# Altium project GPStracker.PrjPcb
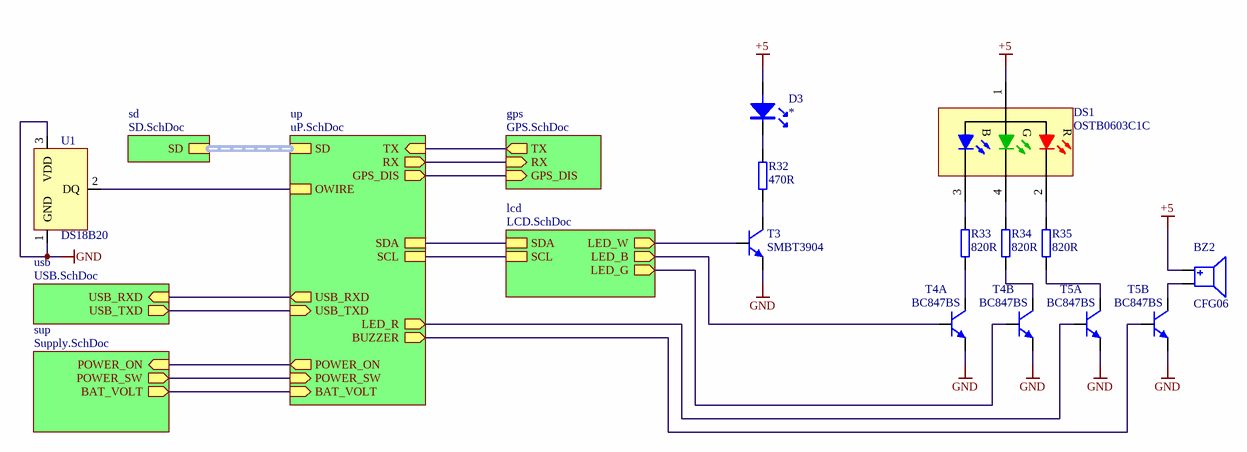
[diagram p0: MAIN.SchDoc]
PCBName: 01; PCBVersion: 2206; PRJName: GPST
7 sheets, 151 parts. Net scope: hierarchical (ports join the sheet entries above them; power ports are global).
Board file: GPST.PcbDoc
Sheets:
  MAIN.SchDoc
    sd = SD.SchDoc
    gps = GPS.SchDoc
    up = uP.SchDoc
    lcd = LCD.SchDoc
    usb = USB.SchDoc
    sup = Supply.SchDoc

## Sheet MAIN.SchDoc: =VariantName
size 274 x 177 mm; Revision: 2206; SheetNumber: 1; SheetTotal: 7; BoardName: GPST-01; ProjectName: GPStracker.PrjPcb

### Parts
BZ2  CFG06  [CFG-06]
D3  *  [LED_0805]
DS1  OSTB0603C1C  [LED0603_4]
R32  470R  [R0805]
R33  820R  [R0805]
R34  820R  [R0805]
R35  820R  [R0805]
T3  SMBT3904  [SOT23J]
T4  BC847BS  [SOT363]  (parts A,B of 2)
T5  BC847BS  [SOT363]  (parts A,B of 2)
U1  DS18B20  [TO-92]

### Sub-sheets
gps = GPS.SchDoc: TX (out), RX (in), GPS_DIS (in)
lcd = LCD.SchDoc: SDA, SCL, LED_G (out), LED_B (out), LED_W (out)
sd = SD.SchDoc: SD
sup = Supply.SchDoc: POWER_ON (in), POWER_SW (out), BAT_VOLT (out)
up = uP.SchDoc: TX (in), RX (out), SDA, OWIRE, SCL, USB_TXD (in), USB_RXD (out), SD (harness SD), GPS_DIS (out), BUZZER (out), LED_R (out), POWER_ON (out), POWER_SW (in), BAT_VOLT (in)
usb = USB.SchDoc: USB_TXD (out), USB_RXD (in)

### Nets
+5: BZ2.+ D3.A DS1.1(A2)
GND: T3.1(E) T4.1(E1) T4.4(E2) T5.1(E1) T5.4(E2) U1.1(GND) U1.3(VDD)
BAT_VOLT: sheet up/BAT_VOLT, sheet sup/BAT_VOLT
BUZZER: T5.5(B2) ; sheet up/BUZZER
GPS_DIS: sheet gps/GPS_DIS, sheet up/GPS_DIS
LED_B: T4.2(B1) ; sheet lcd/LED_B
LED_G: T4.5(B2) ; sheet lcd/LED_G
LED_R: T5.2(B1) ; sheet up/LED_R
LED_W: T3.2(B) ; sheet lcd/LED_W
OWIRE: U1.2(DQ) ; sheet up/OWIRE
POWER_ON: sheet up/POWER_ON, sheet sup/POWER_ON
POWER_SW: sheet up/POWER_SW, sheet sup/POWER_SW
SCL: sheet up/SCL, sheet lcd/SCL
SDA: sheet up/SDA, sheet lcd/SDA
USB_RXD: sheet up/USB_RXD, sheet usb/USB_RXD
USB_TXD: sheet up/USB_TXD, sheet usb/USB_TXD
NetBZ2_-: BZ2.- T5.6(C2)
NetD3_K: D3.K R32.2
NetDS1_2: DS1.2(R) R35.1
NetDS1_3: DS1.3(B) R33.1
NetDS1_4: DS1.4(G) R34.1
NetR10_2: sheet gps/TX, sheet up/TX
NetR11_2: sheet gps/RX, sheet up/RX
NetR32_1: R32.1 T3.3(C)
NetR33_2: R33.2 T4.3(C1)
NetR34_2: R34.2 T4.6(C2)
NetR35_2: R35.2 T5.3(C1)

### Buses and harness runs
harness sheet sd/SD = sheet up/SD

### Notes on the sheet
- Name:
- Device:
- File:

### Library data of the parts
BZ2 = CFG06: BUZZER;; Indeks: MAKB002; P&P: 0; Value: CFG06
D3 = LED: LED;; Indeks: *; Value: *; P&P: *
DS1 = OPTOSUPPLY OSTB0603C1C: LED, RGB, SMD; Indeks: MOPSL068; Obudowa: LED0603; P&P: 1; Value: OSTB0603C1C
R32-R35 = R: R; resistor; Indeks: *; P&P: *
  R32: Value: 470R
  R33-R35: Value: 820R
T3 = SMBT3904: T_NPN; Bipolar Transistor; Indeks: MTRSB002; P&P: 1; Value: SMBT3904
T4 T5 = BC847BS: T_NPN; Bipolar Transistor; pin to pad: 3>6 6>3; Indeks: MTRSB057; P&P: 1; Value: BC847BS
U1 = DS18B20: temperature sensor; Indeks: MUKTC049; P&P: 0; Value: DS18B20

## Sheet SD.SchDoc: =VariantName
size 274 x 177 mm; Revision: 2206; SheetNumber: 2; SheetTotal: 7; BoardName: GPST-01; ProjectName: GPStracker.PrjPcb
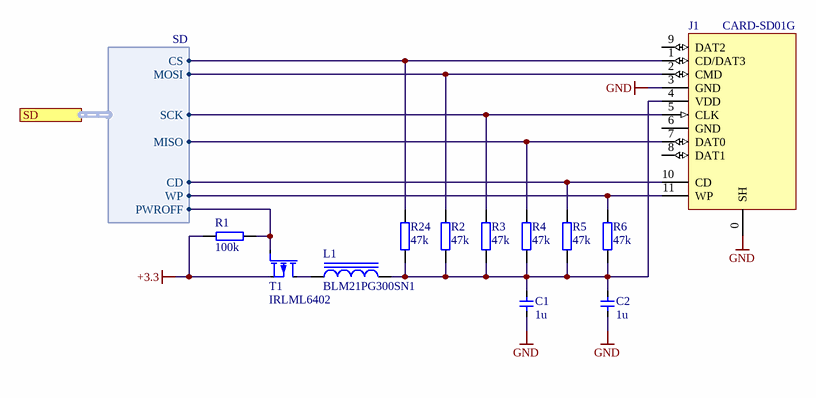
[diagram p1: SD.SchDoc]

### Parts
C1  1u  [C0805]
C2  1u  [C0805]
J1  CARD-SD01G  [CARD-SD01G]
L1  BLM21PG300SN1  [L0805]
R1  100k  [R0805]
R2  47k  [R0805]
R3  47k  [R0805]
R4  47k  [R0805]
R5  47k  [R0805]
R6  47k  [R0805]
R24  47k  [R0805]
T1  IRLML6402  [MICRO3]

### Ports
SD (harness SD)

### Harnesses
SD: PWROFF, CD, WP, CS, MOSI, MISO, SCK

### Nets
+3.3: R1.2 T1.S
GND: C1.1 C2.1 J1.0(SH) J1.3(GND)
SD.CD: J1.10(CD) R5.2 ; port SD.CD
SD.CS: J1.1(CD/DAT3) R24.2 ; port SD.CS
SD.MISO: J1.7(DAT0) R4.2 ; port SD.MISO
SD.MOSI: J1.2(CMD) R2.2 ; port SD.MOSI
SD.PWROFF: R1.1 T1.G ; port SD.PWROFF
SD.SCK: J1.5(CLK) R3.2 ; port SD.SCK
SD.WP: J1.11(WP) R6.2 ; port SD.WP
NetC1_2: C1.2 C2.2 J1.4(VDD) L1.2 R2.1 R3.1 R4.1 R5.1 R6.1 R24.1
NetL1_1: L1.1 T1.D

Not connected (* = marked no-connect by the designer): J1 6(GND) 8(DAT1) 9(DAT2)

### Notes on the sheet
- Name:
- Device:
- File:

### Library data of the parts
C1 C2 = C: C; capacitor; Value: 1u; P&P: *
J1 = SD: SD Card Socket, push-pull; ID: 631; Order Code: CARD-SD01G-LF; Part No: CARD-SD01G; Supplier: Maritex
L1 = BLM21PG300SN1: L;; Indeks: MIDSD062; P&P: 1; Value: BLM21PG300SN1
R1-R6 R24 = R: R; resistor; Indeks: *; P&P: *
  R1: Value: 100k
  R2-R6 R24: Value: 47k
T1 = IRLML6402: T_M_P; P-Channel MOSFET; Indeks: MTRSP030; P&P: 1; Value: IRLML6402

## Sheet GPS.SchDoc: =VariantName
size 274 x 177 mm; Revision: 2206; SheetNumber: 3; SheetTotal: 7; BoardName: GPST-01; ProjectName: GPStracker.PrjPcb
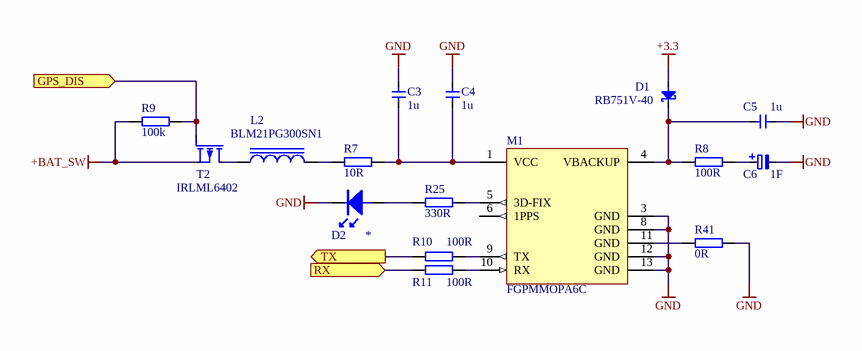
[diagram p2: GPS.SchDoc]

### Parts
C3  1u  [C0805]
C4  1u  [C0805]
C5  1u  [C0805]
C6  1F  [EECRG0V105H]
D1  RB751V-40  [SOD323]
D2  *  [LED_0805]
L2  BLM21PG300SN1  [L0805]
M1  FGPMMOPA6C  [FGPMMOPA6C]
R7  10R  [R0805]
R8  100R  [R0805]
R9  100k  [R0805]
R10  100R  [R0805]
R11  100R  [R0805]
R25  330R  [R0805]
R41  0R  [R0805]
T2  IRLML6402  [MICRO3]

### Ports
GPS_DIS (in), RX (in), TX (out)

### Nets
+3.3: D1.A
+BAT_SW: R9.2 T2.S
GND: C3.1 C4.1 C5.1 C6.- D2.K M1.3(GND) M1.8(GND) M1.12(GND) M1.13(GND) R41.1
GPS_DIS: R9.1 T2.G ; port GPS_DIS
NetC3_2: C3.2 C4.2 M1.1(VCC) R7.1
NetC5_2: C5.2 D1.K M1.4(VBACKUP) R8.2
NetC6_+: C6.+ R8.1
NetD2_A: D2.A R25.2
NetL2_1: L2.1 T2.D
NetL2_2: L2.2 R7.2
NetM1_5: M1.5(3D-FIX) R25.1
NetM1_9: M1.9(TX) R10.1
NetM1_10: M1.10(RX) R11.1
NetM1_11: M1.11(GND) R41.2
NetR10_2: R10.2 ; port TX
NetR11_2: R11.2 ; port RX

Not connected (* = marked no-connect by the designer): M1 6(1PPS)

### Notes on the sheet
- Name:
- Device:
- File:

### Library data of the parts
C3-C5 = C: C; capacitor; Value: 1u; P&P: *
C6 = C_pol: C; Polarized Capacitor; Indeks: MKOT0005213; P&P: 0; Value: 1F
D1 = RB751V-40: DS; Schottky Rectifier; Indeks: MDISS002; P&P: 1; Value: RB751V-40
D2 = LED: LED;; Indeks: *; Value: *; P&P: *
L2 = BLM21PG300SN1: L;; Indeks: MIDSD062; P&P: 1; Value: BLM21PG300SN1
M1 = FGPMMOPA6C: GPS; Indeks: MUKSC480; P&P: 1; Value: FGPMMOPA6C
R7-R11 R25 R41 = R: R; resistor; Indeks: *; P&P: *
  R7: Value: 10R
  R8 R10 R11: Value: 100R
  R9: Value: 100k
  R25: Value: 330R
  R41: Value: 0R
T2 = IRLML6402: as T1 on sheet SD; Value: IRLML6402

## Sheet uP.SchDoc: =VariantName
size 274 x 177 mm; Revision: 2206; SheetNumber: 4; SheetTotal: 7; BoardName: GPST-01; ProjectName: GPStracker.PrjPcb
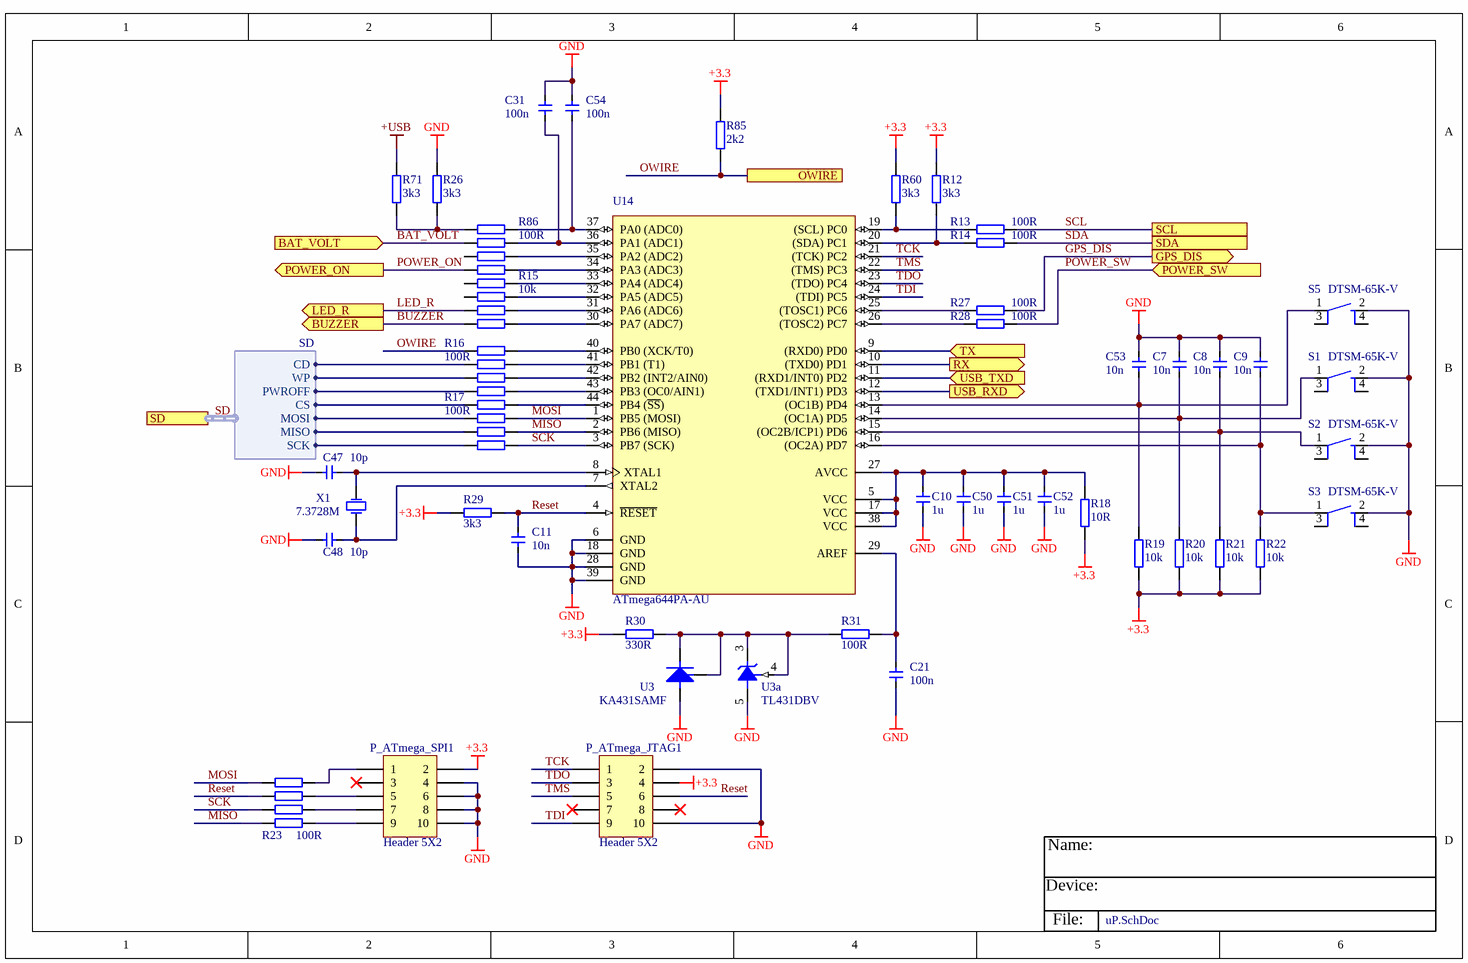
[diagram p3: uP.SchDoc]

### Parts
C7  10n  [C0805]
C8  10n  [C0805]
C9  10n  [C0805]
C10  1u  [C0805]
C11  10n  [C0805]
C21  100n  [C0805]
C31  100n  [C0805]
C47  10p  [C0805]
C48  10p  [C0805]
C50  1u  [C0805]
C51  1u  [C0805]
C52  1u  [C0805]
C53  10n  [C0805]
C54  100n  [C0805]
P_ATmega_JTAG1  Header 5X2  [HDR2X5]
P_ATmega_SPI1  Header 5X2  [HDR2X5]
R12  3k3  [R0805]
R13  100R  [R0805]
R14  100R  [R0805]
R15  10k  [YC164]
R16  100R  [YC164]
R17  100R  [YC164]
R18  10R  [R0805]
R19  10k  [R0805]
R20  10k  [R0805]
R21  10k  [R0805]
R22  10k  [R0805]
R23  100R  [YC164]
R26  3k3  [R0805]
R27  100R  [R0805]
R28  100R  [R0805]
R29  3k3  [R0805]
R30  330R  [R0805]
R31  100R  [R0805]
R60  3k3  [R0805]
R71  3k3  [R0805]
R85  2k2  [R0805]
R86  100R  [YC164]
S1  DTSM-65K-V  [DTSM-65K-V]
S2  DTSM-65K-V  [DTSM-65K-V]
S3  DTSM-65K-V  [DTSM-65K-V]
S5  DTSM-65K-V  [DTSM-65K-V]
U3  KA431SAMF  [SOT23-3]
U3a  TL431DBV  [DBV_R-PDSO-G5]
U14  ATmega644PA-AU  [44A_M]
X1  7.3728M  [HC-49SM]

### Ports
BAT_VOLT (in), BUZZER (out), GPS_DIS (out), LED_R (out), OWIRE, POWER_ON (out), POWER_SW (in), RX (out), SCL, SD (harness SD), SDA, TX (in), USB_RXD (out), USB_TXD (in)

### Harnesses
SD: PWROFF, CD, WP, CS, MOSI, MISO, SCK

### Nets
+3.3: P_ATmega_JTAG1.4 P_ATmega_SPI1.2 R12.2 R18.1 R19.1 R20.1 R21.1 R22.1 R29.1 R30.2 R60.2 R85.2
+USB: R71.2
GND: C7.2 C8.2 C9.2 C10.1 C11.1 C21.1 C31.2 C47.1 C48.1 C50.1 C51.1 C52.1 C53.2 C54.2 P_ATmega_JTAG1.2 P_ATmega_JTAG1.10 P_ATmega_SPI1.4 P_ATmega_SPI1.6 P_ATmega_SPI1.8 P_ATmega_SPI1.10 R26.2 S1.2(S1) S2.2(S1) S3.2(S1) S5.2(S1) U3.3(A) U3a.5(A) U14.6(GND) U14.18(GND) U14.28(GND) U14.39(GND)
BAT_VOLT: R86.3 ; port BAT_VOLT
BUZZER: R15.1 ; port BUZZER
GPS_DIS: R27.1 ; port GPS_DIS
LED_R: R15.2 ; port LED_R
MISO: R17.6 R23.4 U14.2(PB6_(MISO))
MOSI: R17.7 R23.1 U14.1(PB5_(MOSI))
OWIRE: R16.1 R85.1 ; port OWIRE
POWER_ON: R86.1 ; port POWER_ON
POWER_SW: R28.1 ; port POWER_SW
Reset: C11.2 P_ATmega_JTAG1.6 R23.2 R29.2 U14.4(~{RESET})
SCK: R17.5 R23.3 U14.3(PB7_(SCK))
SCL: R13.1 ; port SCL
SD.CD: R16.2 ; port SD.CD
SD.CS: R17.1 ; port SD.CS
SD.MISO: R17.3 ; port SD.MISO
SD.MOSI: R17.2 ; port SD.MOSI
SD.PWROFF: R16.4 ; port SD.PWROFF
SD.SCK: R17.4 ; port SD.SCK
SD.WP: R16.3 ; port SD.WP
SDA: R14.1 ; port SDA
TCK: P_ATmega_JTAG1.1 U14.21((TCK)_PC2)
TDI: P_ATmega_JTAG1.9 U14.24((TDI)_PC5)
TDO: P_ATmega_JTAG1.3 U14.23((TDO)_PC4)
TMS: P_ATmega_JTAG1.5 U14.22((TMS)_PC3)
USB_RXD: U14.12((TXD1/INT1)_PD3) ; port USB_RXD
USB_TXD: U14.11((RXD1/INT0)_PD2) ; port USB_TXD
NetC7_1: C7.1 R20.2 S1.1(P1) U14.14((OC1A)_PD5)
NetC8_1: C8.1 R21.2 S2.1(P1) U14.15((OC2B/ICP1)_PD6)
NetC9_1: C9.1 R22.2 S3.1(P1) U14.16((OC2A)_PD7)
NetC10_2: C10.2 C50.2 C51.2 C52.2 R18.2 U14.5(VCC) U14.17(VCC) U14.27(AVCC) U14.38(VCC)
NetC21_2: C21.2 R31.1 U14.29(AREF)
NetC31_1: C31.1 R86.6 U14.36(PA1_(ADC1))
NetC47_2: C47.2 U14.8(XTAL1) X1.2(OSC2)
NetC48_2: C48.2 U14.7(XTAL2) X1.1(OSC1)
NetC53_1: C53.1 R19.2 S5.1(P1) U14.13((OC1B)_PD4)
NetC54_1: C54.1 R86.5 U14.37(PA0_(ADC0))
NetP_ATmega_SPI1_1: P_ATmega_SPI1.1 R23.8
NetP_ATmega_SPI1_5: P_ATmega_SPI1.5 R23.7
NetP_ATmega_SPI1_7: P_ATmega_SPI1.7 R23.6
NetP_ATmega_SPI1_9: P_ATmega_SPI1.9 R23.5
NetR10_2: U14.9((RXD0)_PD0) ; port TX
NetR11_2: U14.10((TXD0)_PD1) ; port RX
NetR12_1: R12.1 R14.2 U14.20((SDA)_PC1)
NetR13_2: R13.2 R60.1 U14.19((SCL)_PC0)
NetR15_5: R15.5 U14.33(PA4_(ADC4))
NetR15_6: R15.6 U14.32(PA5_(ADC5))
NetR15_7: R15.7 U14.31(PA6_(ADC6))
NetR15_8: R15.8 U14.30(PA7_(ADC7))
NetR16_5: R16.5 U14.43(PB3_(OC0/AIN1))
NetR16_6: R16.6 U14.42(PB2_(INT2/AIN0))
NetR16_7: R16.7 U14.41(PB1_(T1))
NetR16_8: R16.8 U14.40(PB0_(XCK/T0))
NetR17_8: R17.8 U14.44(PB4_(~{SS}))
NetR26_1: R26.1 R71.1 R86.4
NetR27_2: R27.2 U14.25((TOSC1)_PC6)
NetR28_2: R28.2 U14.26((TOSC2)_PC7)
NetR30_1: R30.1 R31.2 U3.1(K) U3.2(R) U3a.3(K) U3a.4(REF)
NetR86_7: R86.7 U14.35(PA2_(ADC2))
NetR86_8: R86.8 U14.34(PA3_(ADC3))

Not connected (* = marked no-connect by the designer): P_ATmega_JTAG1 7* 8*; P_ATmega_SPI1 3*; R15 3 4; R86 2; S1 3(P2) 4(2); S2 3(P2) 4(2); S3 3(P2) 4(2); S5 3(P2) 4(2)

### Buses and harness runs
harness SD = port SD

### Notes on the sheet
- Name:
- Device:
- File:

### Library data of the parts
C7-C9 C11 C53 = c: C; capacitor; Indeks: MKOS0603057; P&P: 1; Value: 10n
C10 C50-C52 = c: C; capacitor; Indeks: MKOS0603021; P&P: 1; Value: 1u
C21 C31 C54 = c: C; capacitor; Indeks: MKOS0603002; P&P: 1; Value: 100n
C47 C48 = c: C; capacitor; Indeks: MKOS0603039; P&P: 1; Value: 10p
P_ATmega_JTAG1 P_ATmega_SPI1 = Header 5X2: Header, 5-Pin, Dual row; Indeks: MZLMP002; P&P: 0; LatestRevisionDate: 17-Jul-2002; LatestRevisionNote: Re-released for DXP Platform.; Publisher: Altium Limited
R12-R14 R18 R26-R29 R60 R71 = R: R; resistor; Indeks: MRESR0603091; P&P: 1
  R12 R26 R29 R60 R71: Value: 3k3
  R13 R14 R27 R28: Value: 100R
  R18: Value: 10R
R15-R17 R23 R86 = YC164: R; Drabinka rezystorowa; Indeks: MRESD4D03003; P&P: 1
  R15: Value: 10k
  R16 R17 R23 R86: Value: 100R
R19-R22 R30 R31 = R: R; resistor; Indeks: *; P&P: *
  R19-R22: Value: 10k
  R30: Value: 330R
  R31: Value: 100R
R85 = R: R; resistor; Indeks: MRESR0603112; P&P: 1; Value: 2k2
S1-S3 S5 = DTSM-65K-V: SWITCH; TACT switch, 6x6, h=9.5mm; Indeks: MPLSM008; P&P: 1; Value: DTSM-65K-V
U3 = KA431SAMF: REF; SOT23; Fairchild; Indeks: MUKSM038; P&P: 1; Value: KA431SAMF; Obudowa: SOT23
U3a = TL431DBV: Adjustable Precision Shunt Regulator; Indeks: MUKSA180; P&P: 1; ComponentLink1Description: Manufacturer Link; ComponentLink1URL: http://www.ti.com/; ComponentLink2Description: Datasheet; ComponentLink2URL: http://www-s.ti.com/sc/ds/tl431a.pdf; Value: TL431DBV
U14 = ATmega644PA: P&P: 1; Indeks: MUKSC1065; Rule: UNIONINDEX{}0[]RULEKIND{}Clearance[]NETSCOPE{}DifferentNets[]LAYERKIND{}SameLayer[]NAME{}Schematic Clearance Constraint[]GAP{}7.874mil[]GENERICCLEARANCE{}7.874mil[]OBJECTCLEARANCES{} []UNIT{}Metric[]PcbType{}ProtelPcb; PackageReference: 44A; PackageDescription: 44-Pin Plastic Thin Profile Quad Flat Pack, 10 x 10 x 1.0 mm Body, 0.8 mm Pitch (TQFP); Value: ATmega644PA-AU
X1 = XTAL: OSC_Q; Crystal Oscillator; Indeks: MRZS052; P&P: 0; Value: 7.3728M

## Sheet LCD.SchDoc: =VariantName
size 274 x 177 mm; Revision: 2206; SheetNumber: 5; SheetTotal: 7; BoardName: GPST-01; ProjectName: GPStracker.PrjPcb
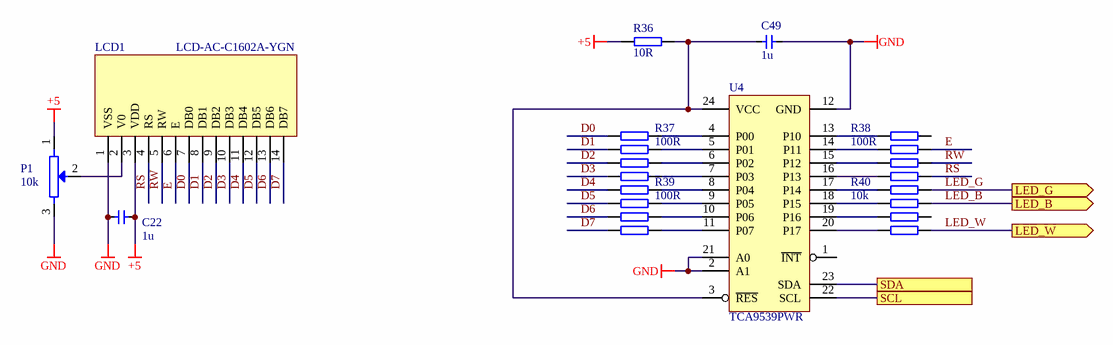
[diagram p4: LCD.SchDoc]

### Parts
C22  1u  [C0805]
C49  1u  [C0805]
LCD1  LCD-AC-C1602A-YGN  [LCD-AC-C1602A-YGN]
P1  10k  [POT67Y]
R36  10R  [R0805]
R37  100R  [YC164]
R38  100R  [YC164]
R39  100R  [YC164]
R40  10k  [YC164]
U4  TCA9539PWR  [PW_R-PDSO-G24]

### Ports
LED_B (out), LED_G (out), LED_W (out), SCL, SDA

### Nets
+5: C22.1 LCD1.3(VDD) P1.1 R36.2
GND: C22.2 C49.1 LCD1.1(VSS) P1.3 U4.2(A1) U4.12(GND) U4.21(A0)
D0: LCD1.7(DB0) R37.4
D1: LCD1.8(DB1) R37.3
D2: LCD1.9(DB2) R37.2
D3: LCD1.10(DB3) R37.1
D4: LCD1.11(DB4) R39.4
D5: LCD1.12(DB5) R39.3
D6: LCD1.13(DB6) R39.2
D7: LCD1.14(DB7) R39.1
E: LCD1.6(E) R38.6
LED_B: R40.6 ; port LED_B
LED_G: R40.5 ; port LED_G
LED_W: R40.8 ; port LED_W
RS: LCD1.4(RS) R38.8
RW: LCD1.5(RW) R38.7
SCL: U4.22(SCL) ; port SCL
SDA: U4.23(SDA) ; port SDA
NetC49_2: C49.2 R36.1 U4.3(~{RES}) U4.24(VCC)
NetLCD1_2: LCD1.2(V0) P1.2
NetR37_5: R37.5 U4.4(P00)
NetR37_6: R37.6 U4.5(P01)
NetR37_7: R37.7 U4.6(P02)
NetR37_8: R37.8 U4.7(P03)
NetR38_1: R38.1 U4.16(P13)
NetR38_2: R38.2 U4.15(P12)
NetR38_3: R38.3 U4.14(P11)
NetR38_4: R38.4 U4.13(P10)
NetR39_5: R39.5 U4.8(P04)
NetR39_6: R39.6 U4.9(P05)
NetR39_7: R39.7 U4.10(P06)
NetR39_8: R39.8 U4.11(P07)
NetR40_1: R40.1 U4.20(P17)
NetR40_2: R40.2 U4.19(P16)
NetR40_3: R40.3 U4.18(P15)
NetR40_4: R40.4 U4.17(P14)

Not connected (* = marked no-connect by the designer): R38 5; R40 7; U4 1(~{INT})

### Notes on the sheet
- Name:
- Device:
- File:

### Library data of the parts
C22 C49 = c: as C10 on sheet uP; Value: 1u
LCD1 = LCD-AC-C1602A-YGN: P&P: 0; Value: LCD-AC-C1602A-YGN; Indeks: *
P1 = POT67Y: R_P; P&P: 0; Value: 10k
R36 = R: as R12 on sheet uP; Value: 10R
R37-R40 = YC164: as R15 on sheet uP
  R37-R39: Value: 100R
  R40: Value: 10k
U4 = TCA9539PWR: I2C 16-BIT port; Indeks: MUKSC382; P&P: 1; Value: TCA9539PWR

## Sheet USB.SchDoc: =VariantName
size 274 x 177 mm; Revision: 2206; SheetNumber: 6; SheetTotal: 7; BoardName: GPST-01; ProjectName: GPStracker.PrjPcb
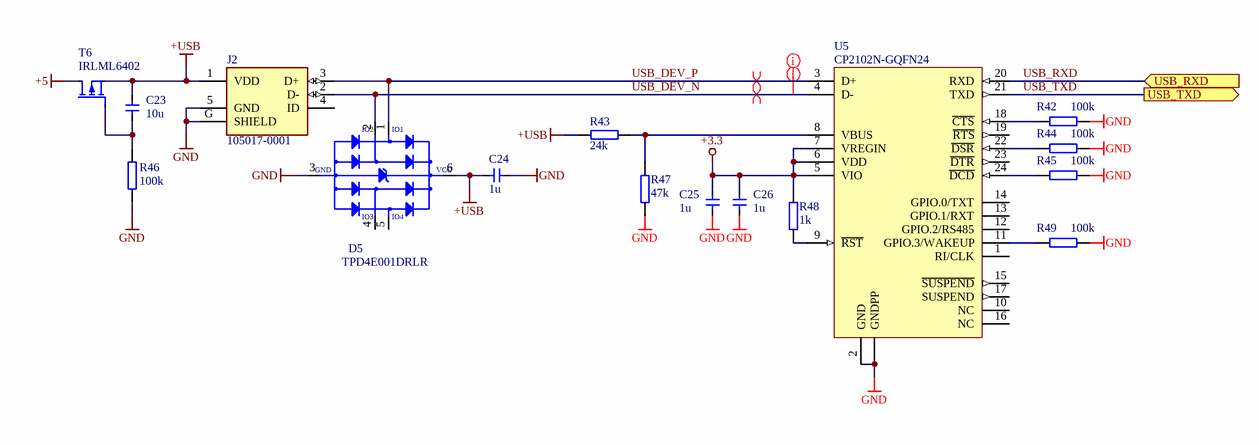
[diagram p5: USB.SchDoc]

### Parts
C23  10u  [C0805]
C24  1u  [C0805]
C25  1u  [C0805]
C26  1u  [C0805]
D5  TPD4E001DRLR  [DRL_R-PDSO-N6]
J2  105017-0001  [MOLEX_105017-0001]
R42  100k  [R0805]
R43  24k  [R0805]
R44  100k  [R0805]
R45  100k  [R0805]
R46  100k  [R0805]
R47  47k  [R0805]
R48  1k  [R0805]
R49  100k  [R0805]
T6  IRLML6402  [MICRO3]
U5  CP2102N-GQFN24  [RGE_S-PVQFN-N24-B]

### Ports
USB_RXD (in), USB_TXD (out)

### Nets
+3.3: C25.2 C26.1 R48.1 U5.5(VIO) U5.6(VDD) U5.7(VREGIN)
+5: T6.D
+USB: C23.2 C24.2 D5.6 J2.1(VDD) R43.1 T6.S
GND: C24.1 C25.1 C26.2 D5.3 J2.5(GND) J2.G(SHIELD) R42.1 R44.1 R45.1 R46.1 R47.1 R49.1 U5.0(GNDPP) U5.2(GND)
USB_DEV_N: D5.2 J2.2(D-) U5.4(D-)
USB_DEV_P: D5.1 J2.3(D+) U5.3(D+)
USB_RXD: U5.20(RXD) ; port USB_RXD
USB_TXD: U5.21(TXD) ; port USB_TXD
NetC23_1: C23.1 R46.2 T6.G
NetR42_2: R42.2 U5.18(~{CTS})
NetR43_2: R43.2 R47.2 U5.8(VBUS)
NetR44_2: R44.2 U5.22(~{DSR})
NetR45_2: R45.2 U5.24(~{DCD})
NetR48_2: R48.2 U5.9(~{RST})
NetR49_2: R49.2 U5.11(GPIO.3/WAKEUP)

Not connected (* = marked no-connect by the designer): D5 4 5; J2 4(ID); U5 1(RI/CLK) 10(NC) 12(GPIO.2/RS485) 13(GPIO.1/RXT) 14(GPIO.0/TXT) 15(~{SUSPEND}) 16(NC) 17(SUSPEND) 19(~{RTS}) 23(~{DTR})

### Layout directives
net class usb: USB_DEV_N, USB_DEV_P
differential pair: USB_DEV_N, USB_DEV_P

### Notes on the sheet
- Name:
- Device:
- File:
- (in symbol TPD4E001DRLR) IO2; IO1; GND; VCC; IO3; IO4

### Library data of the parts
C23 C24 = c: as C10 on sheet uP
  C23: Value: 10u
  C24: Value: 1u
C25 = C: capacitor; Indeks: MKOS0603021; Nap robocze: 10V; Technologia: X5R; P&P: 1; Value: 1u
C26 = C: capacitor; Indeks: MKOS0603021; Nap robocze: 10V; P&P: 1; Value: 1u
D5 = TPD4E001DRLR: D_; ESD Protection; Indeks: MUKSA198; P&P: 1; Value: TPD4E001DRLR
J2 = 105017-0001: CON; USB; micro B USB 2.0 Receptacle Connector 5 Position Surface Mount, Right Angle; Through Hole; Indeks: MZLZK191; P&P: 1; Value: 105017-0001
R42 R44 R45 R49 = R: resistor; Indeks: MRESR0603013; Tolerancja: 1%; P&P: 1; Value: 100k
R43 = R: resistor; Indeks: MRESR0603059; P&P: 1; Value: 24k
R46 = R: R; resistor; Value: 100k; Indeks: *; P&P: *
R47 = R: resistor; Indeks: MRESR0603035; P&P: 1; Value: 47k
R48 = R: resistor; Indeks: MRESR0603017; P&P: 1; Value: 1k
T6 = IRLML6402: as T1 on sheet SD; Value: IRLML6402
U5 = CP2102N-xxx-GQFN24: USB-to-UART (USB 2.0 Full-Speed) Bridge Controller; Indeks: MUKSC1012; P&P: 1; Value: CP2102N-GQFN24

## Sheet Supply.SchDoc: =VariantName
size 274 x 177 mm; Revision: 2206; SheetNumber: 7; SheetTotal: 7; BoardName: GPST-01; ProjectName: GPStracker.PrjPcb
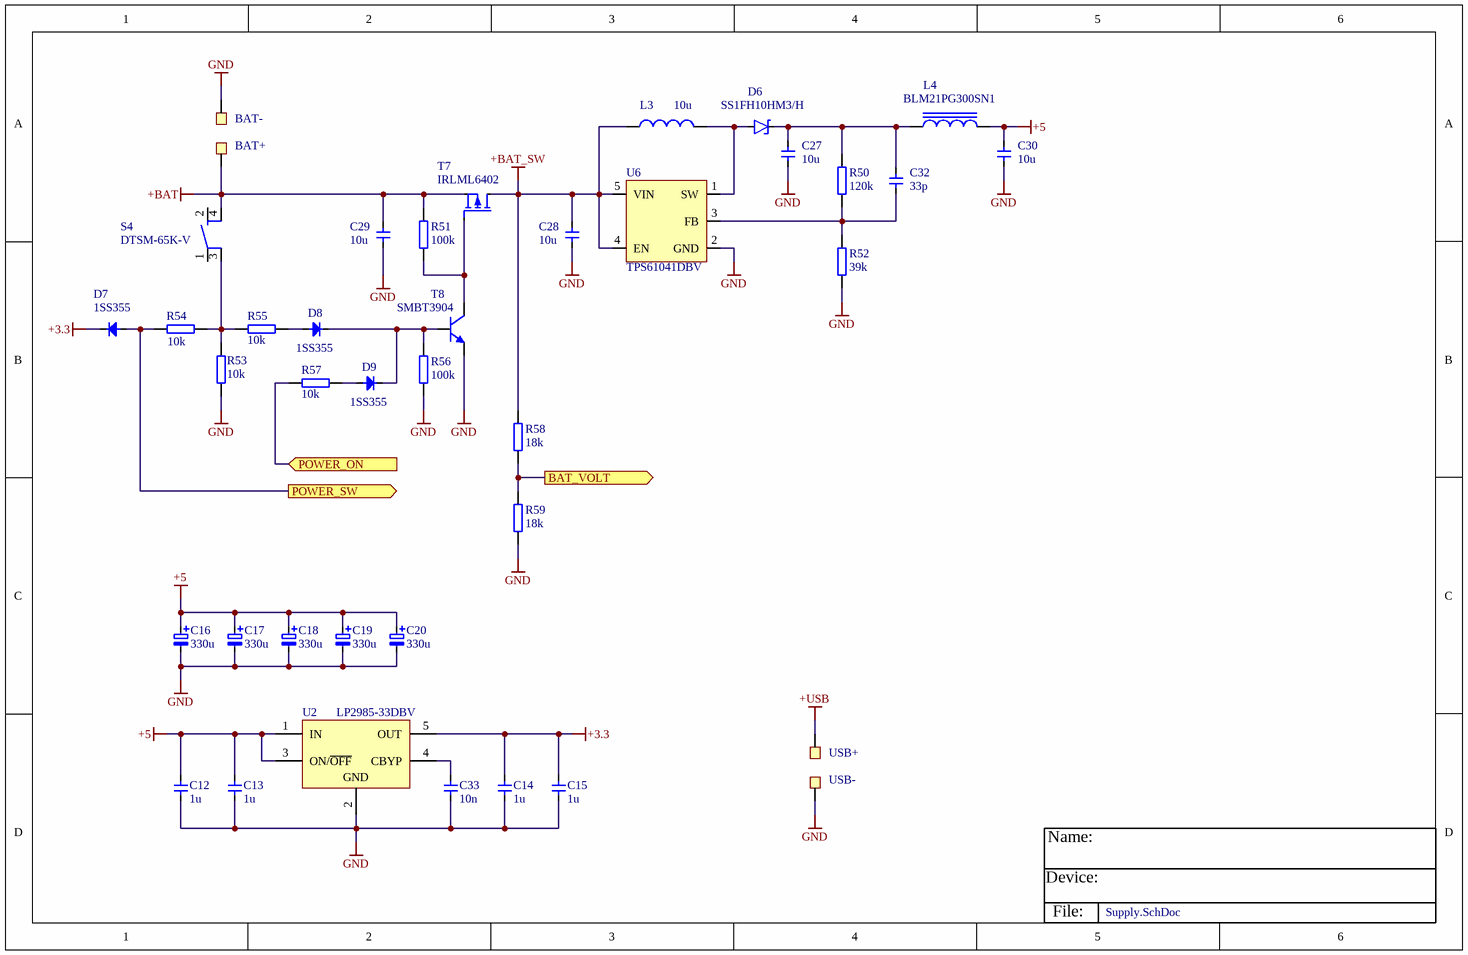
[diagram p6: Supply.SchDoc]

### Parts
BAT+  PAD  [PAD_SMD_2x4]  (value not drawn)  (no BOM)
BAT-  PAD  [PAD_SMD_2x4]  (value not drawn)  (no BOM)
C12  1u  [C0805]
C13  1u  [C0805]
C14  1u  [C0805]
C15  1u  [C0805]
C16  330u  [D]
C17  330u  [D]
C18  330u  [D]
C19  330u  [D]
C20  330u  [D]
C27  10u  [C0805]
C28  10u  [C0805]
C29  10u  [C0805]
C30  10u  [C0805]
C32  33p  [C0805]
C33  10n  [C0805]
D6  SS1FH10HM3/H  [DO-219AB]
D7  1SS355  [SOD323]
D8  1SS355  [SOD323]
D9  1SS355  [SOD323]
L3  10u  [L1008]
L4  BLM21PG300SN1  [L0805]
R50  120k  [R0805]
R51  100k  [R0805]
R52  39k  [R0805]
R53  10k  [R0805]
R54  10k  [R0805]
R55  10k  [R0805]
R56  100k  [R0805]
R57  10k  [R0805]
R58  18k  [R0805]
R59  18k  [R0805]
S4  DTSM-65K-V  [DTSM-65K-V]
T7  IRLML6402  [MICRO3]
T8  SMBT3904  [SOT23J]
U2  LP2985-33DBV  [DBV_R-PDSO-G5]
U6  TPS61041DBV  [DBV_R-PDSO-G5]
USB+  PAD  [PAD_SMD_2x4]  (value not drawn)  (no BOM)
USB-  PAD  [PAD_SMD_2x4]  (value not drawn)  (no BOM)

### Ports
BAT_VOLT (out), POWER_ON (in), POWER_SW (out)

### Nets
+3.3: C14.2 C15.2 D7.K U2.5(OUT)
+5: C12.2 C13.2 C16.+ C17.+ C18.+ C19.+ C20.+ C30.2 L4.2 U2.1(IN) U2.3(ON/~{OFF})
+BAT: BAT+.1 C29.2 R51.1 S4.4 T7.S
+BAT_SW: C28.2 L3.1 R58.1 T7.D U6.4(EN) U6.5(VIN)
+USB: USB+.1
GND: BAT-.1 C12.1 C13.1 C14.1 C15.1 C16.- C17.- C18.- C19.- C20.- C27.1 C28.1 C29.1 C30.1 C33.1 R52.2 R53.1 R56.2 R59.2 T8.1(E) U2.2(GND) U6.2(GND) USB-.1
BAT_VOLT: R58.2 R59.1 ; port BAT_VOLT
POWER_ON: R57.1 ; port POWER_ON
POWER_SW: D7.A R54.1 ; port POWER_SW
NetC27_2: C27.2 C32.2 D6.K L4.1 R50.1
NetC32_1: C32.1 R50.2 R52.1 U6.3(FB)
NetC33_2: C33.2 U2.4(CBYP)
NetD6_A: D6.A L3.2 U6.1(SW)
NetD8_A: D8.A R55.2
NetD8_K: D8.K D9.K R56.1 T8.2(B)
NetD9_A: D9.A R57.2
NetR51_2: R51.2 T7.G T8.3(C)
NetR53_2: R53.2 R54.2 R55.1 S4.3(P2)

Not connected (* = marked no-connect by the designer): S4 1(P1) 2(S1)

### Notes on the sheet
- Name:
- Device:
- File:

### Library data of the parts
BAT+ BAT- USB+ USB- = CON1: CON;; P&P: 0; Value: PAD
C12-C15 C27-C30 C32 C33 = c: as C10 on sheet uP
  C12-C15: Value: 1u
  C27-C30: Value: 10u
  C32: Value: 33p
  C33: Value: 10n
C16-C20 = C_pol: C; Polarized Capacitor; Value: 330u
D6 = SS1FH10HM3/H: DS; Schottky Power Rectifier 1A 100V; Indeks: MDISS139; Nap robocze: 100V 1A; Obudowa: SMF; P&P: 1; Value: SS1FH10HM3/H
D7-D9 = 1SS355: D; Diode general; Indeks: MDISL001; P&P: 1; Value: 1SS355
L3 = L: L;; Indeks: MIDSD252; P&P: 1; Value: 10u
L4 = BLM21PG300SN1: L;; Indeks: MIDSD062; P&P: 1; Value: BLM21PG300SN1
R50-R59 = R: R; resistor; Indeks: *; P&P: *
  R50: Value: 120k
  R51 R56: Value: 100k
  R52: Value: 39k
  R53-R55 R57: Value: 10k
  R58 R59: Value: 18k
S4 = DTSM-65K-V: as S1 on sheet uP; Value: DTSM-65K-V
T7 = IRLML6402: as T1 on sheet SD; Value: IRLML6402
T8 = SMBT3904: as T3 on sheet MAIN; Value: SMBT3904
U2 = LP2985-33DBV: LDO; Micropower 150 mA Low-Noise Ultra Low-Dropout Regulator in  SOT-23 and micro SMD Packages; PartNumber: LP2985AIM5-3.3; Manufacturer: National Semiconductor; CompType: LDO IC; PackageTopMarking: L0RA*XTT; PowerWise: N; Indeks: MUKSC203; P&P: 1; Published: 4-Dec-2008; DatasheetVersion: Jul-2007; PackageVersion: revD, Aug-2008; PackageReference: MF05A; Publisher: Altium Limited; PackageDescription: Molded SOT-23, .115 x .063 x .040 in Body, 5 Lead, .0375 in Pitch; RoHS: O; PinCount: 5; DigiKeyPartNumber: LP2985AIM5-3.3CT-ND; ComponentLink1Description: LP2985 Datasheet; ComponentLink1URL: http://www.national.com/ds/LP/LP2985.pdf; ComponentLink2Description: LP2985 Web Page; ComponentLink2URL: http://www.national.com/pf/LP/LP2985.html; ComponentLink3Description: MF05A Package Page; ComponentLink3URL: http://www.national.com/packaging/folders/mf05a.html; Value: LP2985-33DBV
U6 = TPS61041DBV: DC/DC; 28V, 250mA Switch Boost Converter for LCD and White LED Applications; Indeks: MUKSC162; P&P: 1; Value: TPS61041DBV

## Nets that join several sheets
+3.3: SD (R1.2 T1.S), GPS (D1.A), uP (12 pins), USB (6 pins), Supply (C14.2 C15.2 D7.K U2.5)
+5: MAIN (BZ2.+ D3.A DS1.1), LCD (C22.1 LCD1.3 P1.1 R36.2), USB (T6.D), Supply (11 pins)
+BAT_SW: GPS (R9.2 T2.S), Supply (6 pins)
+USB: uP (R71.2), USB (6 pins), Supply (USB+.1)
GND: MAIN (7 pins), SD (C1.1 C2.1 J1.0 J1.3), GPS (10 pins), uP (31 pins), LCD (7 pins), USB (14 pins), Supply (23 pins)
BAT_VOLT: uP (R86.3), Supply (R58.2 R59.1)
BUZZER: MAIN (T5.5), uP (R15.1)
GPS_DIS: GPS (R9.1 T2.G), uP (R27.1)
LED_B: MAIN (T4.2), LCD (R40.6)
LED_G: MAIN (T4.5), LCD (R40.5)
LED_R: MAIN (T5.2), uP (R15.2)
LED_W: MAIN (T3.2), LCD (R40.8)
NetR10_2: GPS (R10.2), uP (U14.9)
NetR11_2: GPS (R11.2), uP (U14.10)
OWIRE: MAIN (U1.2), uP (R16.1 R85.1)
POWER_ON: uP (R86.1), Supply (R57.1)
POWER_SW: uP (R28.1), Supply (D7.A R54.1)
SCL: uP (R13.1), LCD (U4.22)
SD.CD: SD (J1.10 R5.2), uP (R16.2)
SD.CS: SD (J1.1 R24.2), uP (R17.1)
SD.MISO: SD (J1.7 R4.2), uP (R17.3)
SD.MOSI: SD (J1.2 R2.2), uP (R17.2)
SD.PWROFF: SD (R1.1 T1.G), uP (R16.4)
SD.SCK: SD (J1.5 R3.2), uP (R17.4)
SD.WP: SD (J1.11 R6.2), uP (R16.3)
SDA: uP (R14.1), LCD (U4.23)
USB_RXD: uP (U14.12), USB (U5.20)
USB_TXD: uP (U14.11), USB (U5.21)